# EAGLE design BBB_XM1100_CAPE (EAGLE 6.6.0)
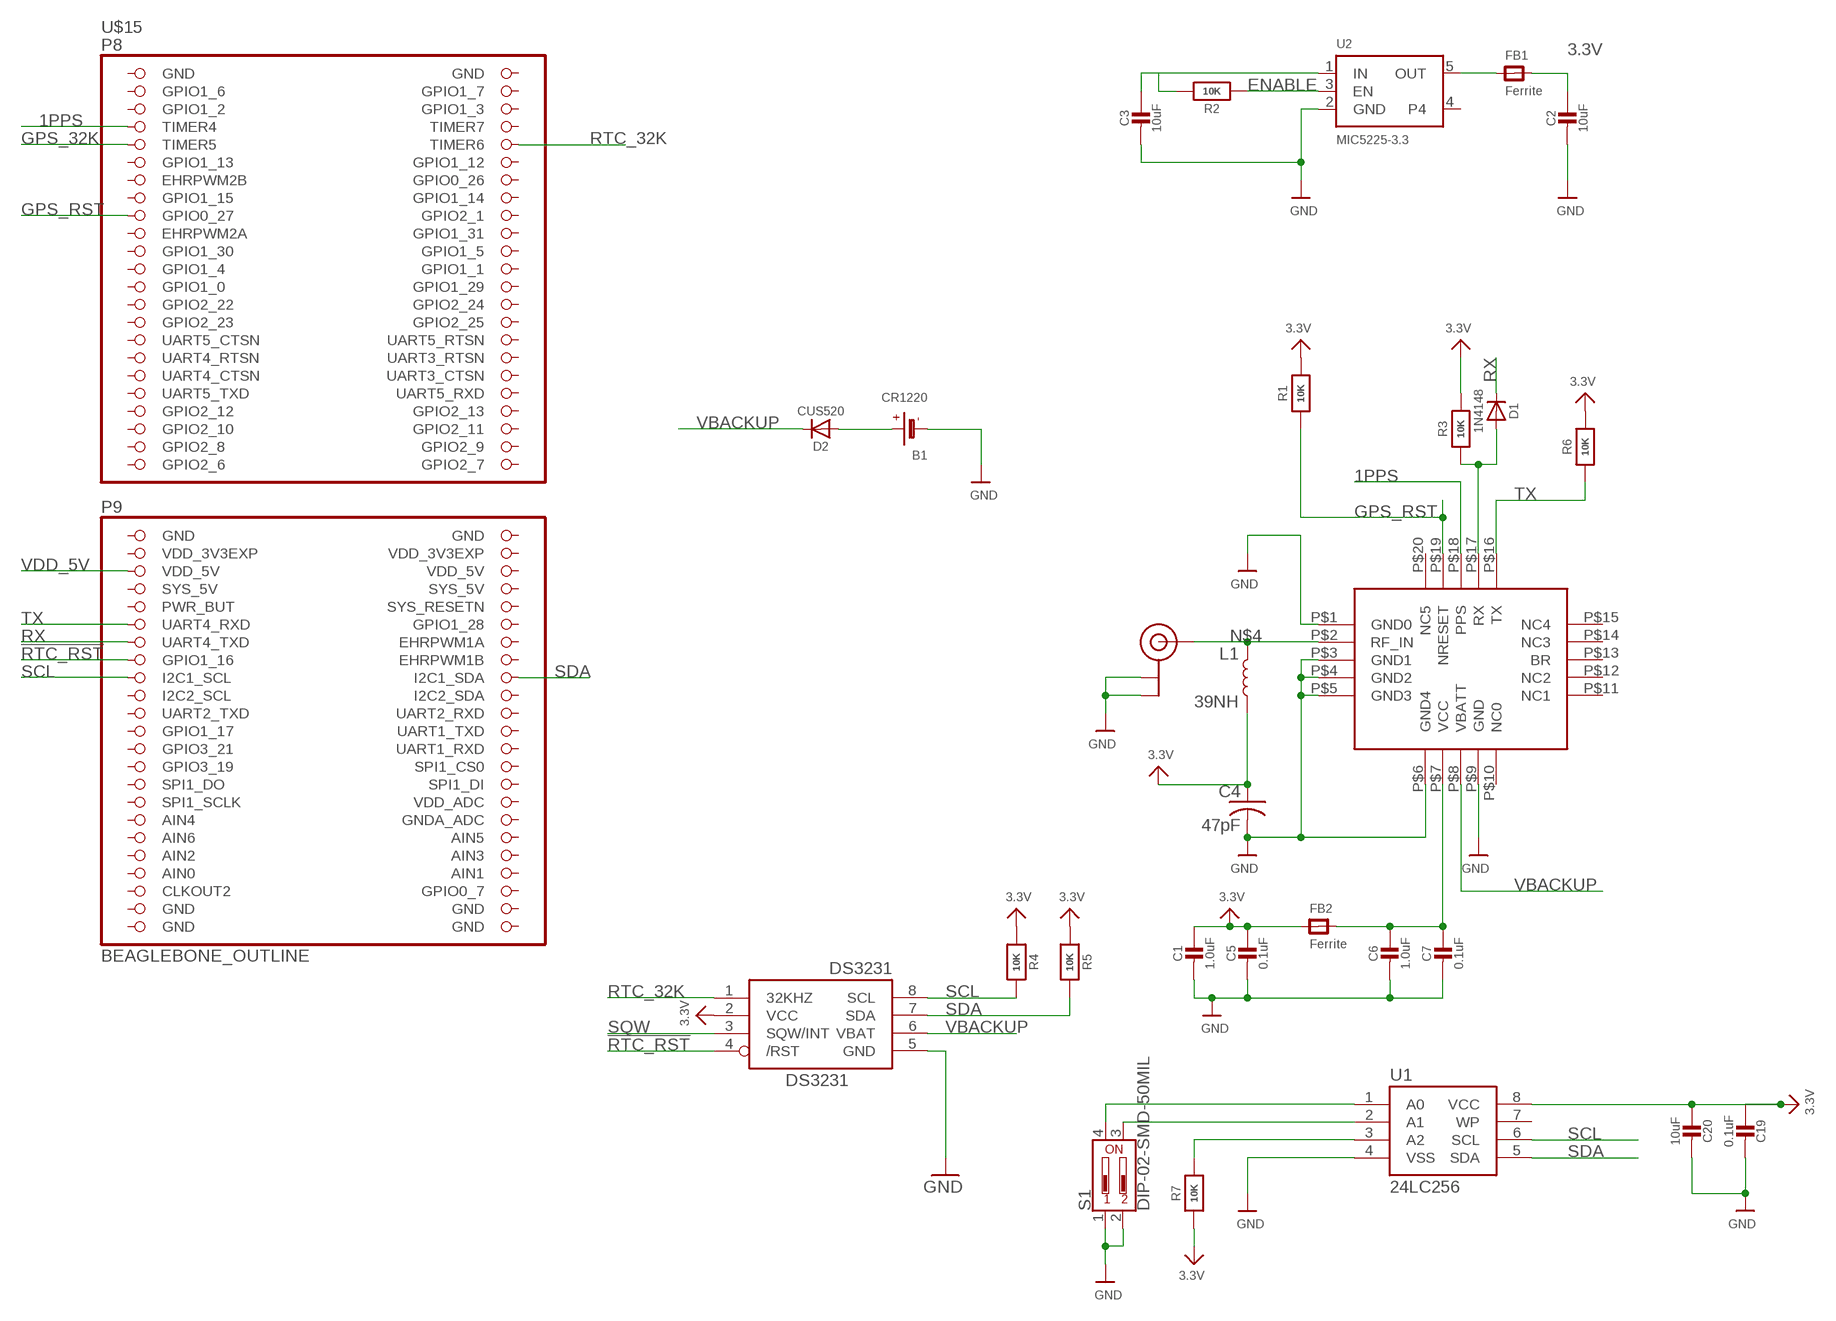
[diagram p0: schematic, sheet 1]

## Parts
B1  CR1220  BATTERYCR1220_SMT  [CR1220]
C1  1.0uF  CAP_CERAMIC0805-NOOUTLINE  [0805-NO]
C2  10uF  CAP_CERAMIC0805-NOOUTLINE  [0805-NO]
C3  10uF  CAP_CERAMIC0805-NOOUTLINE  [0805-NO]
C4  47pF  C-USC0805  [C0805]
C5  0.1uF  CAP_CERAMIC0805-NOOUTLINE  [0805-NO]
C6  1.0uF  CAP_CERAMIC0805-NOOUTLINE  [0805-NO]
C7  0.1uF  CAP_CERAMIC0805-NOOUTLINE  [0805-NO]
C19  0.1uF  CAP_CERAMIC0805-NOOUTLINE  [0805-NO]
C20  10uF  CAP_CERAMIC0805-NOOUTLINE  [0805-NO]
D1  1N4148  DIODESOD-323  [SOD-323]
D2  CUS520  DIODESOD-323  [SOD-323]
DS3231  DS3231M-8PIN  [SO08]
FB1  Ferrite  FERRITE-0805NO  [0805-NO@1]
FB2  Ferrite  FERRITE-0805NO  [0805-NO@1]
L1  39NH  INDUCTOR-0402-3.9NH  [0402]
R1  10K  RESISTOR0805_NOOUTLINE  [0805-NO]
R2  10K  RESISTOR0805_NOOUTLINE  [0805-NO]
R3  10K  RESISTOR0805_NOOUTLINE  [0805-NO]
R4  10K  RESISTOR0805_NOOUTLINE  [0805-NO]
R5  10K  RESISTOR0805_NOOUTLINE  [0805-NO]
R6  10K  RESISTOR0805_NOOUTLINE  [0805-NO]
R7  10K  RESISTOR0805_NOOUTLINE  [0805-NO]
S1  DIP-02-SMD-50MIL  [DIPSWITCH-02-50MIL]
U1  24LC256  EEPROM-I2CSMD  [SO08]
U2  MIC5225-3.3  VREG_SOT23-5  [SOT23-5]
U$3  XM1100  [XM1100]
U$15  BEAGLEBONE_OUTLINE  [BEAGLEBONE_SHIELD]
U$20  U.FL  [U.FL]

## Nets
1PPS: U$3.P$18(PPS) U$15.7(TIMER4)
3.3V: C1.1 C2.1 C4.1 C5.1 C19.1 C20.1 DS3231.2(VCC) FB1.2 FB2.1 L1.2 R1.1 R3.1 R4.1 R5.1 R6.1 R7.1 U1.8(VCC)
!RTC_RST: DS3231.4(/RST) U$15.61(GPIO1_16)
ENABLE: R2.1 U2.3(EN)
GND: B1.- C1.2 C2.2 C3.2 C4.2 C5.2 C6.2 C7.2 C19.2 C20.2 DS3231.5(GND) S1.1 S1.2 U1.4(VSS) U2.2(GND) U$3.P$1(GND0) U$3.P$3(GND1) U$3.P$4(GND2) U$3.P$5(GND3) U$3.P$6(GND4) U$3.P$9(GND) U$20.P$1(GND) U$20.P$2(GND)
GPS_32K: U$15.9(TIMER5)
GPS_RST: R1.2 U$3.P$19(NRESET) U$15.17(GPIO0_27)
N$1: B1.+$1(+) D2.A
N$3: FB1.1 U2.5(OUT)
N$4: L1.1 U$3.P$2(RF_IN) U$20.P$3(SIGNAL)
N$5: C6.1 C7.1 FB2.2 U$3.P$7(VCC)
N$13: R7.2 U1.3(A2)
N$15: S1.3 U1.2(A1)
N$16: S1.4 U1.1(A0)
RTC_32K: DS3231.1(32KHZ) U$15.10(TIMER6)
RX: D1.C U$15.59(UART4_TXD)
RX_3V: D1.A R3.2 U$3.P$17(RX)
SCL: DS3231.8(SCL) R4.2 U1.6(SCL) U$15.63(I2C1_SCL)
SDA: DS3231.7(SDA) R5.2 U1.5(SDA) U$15.64(I2C1_SDA)
SQW: DS3231.3(SQW/INT)
TX: R6.2 U$3.P$16(TX) U$15.57(UART4_RXD)
VBACKUP: D2.C DS3231.6(VBAT) U$3.P$8(VBATT)
VDD_5V: C3.1 R2.2 U2.1(IN) U$15.51(VDD_5V)
Unconnected: U1.7(WP) U2.4 U$3.P$10(NC0) U$3.P$11(NC1) U$3.P$12(NC2) U$3.P$13(BR) U$3.P$14(NC3) U$3.P$15(NC4) U$3.P$20(NC5) U$15.3(GPIO1_6) U$15.4(GPIO1_7) U$15.5(GPIO1_2) U$15.6(GPIO1_3) U$15.8(TIMER7) U$15.11(GPIO1_13) U$15.12(GPIO1_12) U$15.13(EHRPWM2B) U$15.14(GPIO0_26) U$15.15(GPIO1_15) U$15.16(GPIO1_14) U$15.18(GPIO2_1) U$15.19(EHRPWM2A) U$15.20(GPIO1_31) U$15.21(GPIO1_30) U$15.22(GPIO1_5) U$15.23(GPIO1_4) U$15.24(GPIO1_1) U$15.25(GPIO1_0) U$15.26(GPIO1_29) U$15.27(GPIO2_22) U$15.28(GPIO2_24) U$15.29(GPIO2_23) U$15.30(GPIO2_25) U$15.31(UART5_CTSN) U$15.32(UART5_RTSN) U$15.33(UART4_RTSN) U$15.34(UART3_RTSN) U$15.35(UART4_CTSN) U$15.36(UART3_CTSN) U$15.37(UART5_TXD) U$15.38(UART5_RXD) U$15.39(GPIO2_12) U$15.40(GPIO2_13) U$15.41(GPIO2_10) U$15.42(GPIO2_11) U$15.43(GPIO2_8) U$15.44(GPIO2_9) U$15.45(GPIO2_6) U$15.46(GPIO2_7) U$15.54(SYS_5V) U$15.55(PWR_BUT) U$15.56(SYS_RESETN) U$15.58(GPIO1_28) U$15.60(EHRPWM1A) U$15.62(EHRPWM1B) U$15.65(I2C2_SCL) U$15.66(I2C2_SDA) U$15.67(UART2_TXD) U$15.68(UART2_RXD) U$15.69(GPIO1_17) U$15.70(UART1_TXD) U$15.71(GPIO3_21) U$15.72(UART1_RXD) U$15.73(GPIO3_19) U$15.74(SPI1_CS0) U$15.75(SPI1_DO) U$15.76(SPI1_DI) U$15.77(SPI1_SCLK) U$15.78(VDD_ADC) U$15.79(AIN4) U$15.80(GNDA_ADC) U$15.81(AIN6) U$15.82(AIN5) U$15.83(AIN2) U$15.84(AIN3) U$15.86(AIN1) U$15.87(CLKOUT2) U$15.88(GPIO0_7)

## Power pins joined to a net without a drawn wire
AIN0: U$15.85(AIN0)
GND: U$15.1(GND) U$15.2(GND) U$15.47(GND) U$15.48(GND) U$15.89(GND) U$15.90(GND) U$15.91(GND) U$15.92(GND)
SYS_5V: U$15.53(SYS_5V)
VDD_3V3EXP: U$15.49(VDD_3V3EXP) U$15.50(VDD_3V3EXP)
VDD_5V: U$15.52(VDD_5V)

## Library data of the parts
B1 = microbuilder:BATTERY: CR1220 SMT - Digikey: 3001K-ND CD2032 BAT-HLD-001 - Digikey: BAT-HLD-001-ND
C1-C3 C5-C7 C19 C20 = microbuilder:CAP_CERAMIC: Ceramic Capacitors For new designs, use the packages preceded by an '_' character since they are more reliable: The following footprints should be used on most boards: _0402 - Standard footprint for regular board layouts _0603 - Standard footprint for regular board layouts _0805 - Standard footprint for regular board layouts _1206 - Standard footprint for regular board layouts For extremely tight-pitch boards where space is at a premium, the following 'micro-pitch' footprints can be used (smaller pads, no silkscreen outline, etc.): _0402MP - Micro-pitch footprint for very dense/compact boards _0603MP - Micro-pitch footprint for very dense/compact boards _0805MP - Micro-pitch footprint for very dense/compact boards _1206MP - Micro-pitch footprint for very dense/compact boards
C4 = rcl:C-US: CAPACITOR, American symbol
D1 D2 = microbuilder:DIODE: Diode SMA Model Volts Amps Type Vf Ir Digikey # Notes SSA34-E3 40V 3A Schottky 480mV @ 3A 200uA @ 40V SSA34-E3/61TGITR-ND CDBA120-G 20V 1A Schottky 500mV @ 1A 500uA @ 20V 641-1014-6-ND REEL MBRA210 10V 2A Schottky 350mV @ 2A 700uA @ 10V MBRA210LT3 SOD-123 Model Volts Amps Type Vf Ir Order # Notes BAT54T1G 30V 200mA Schottky 800mV @ 200mA 2uA @ 25V BAT54T1GOSTR-ND B0530W 30V 500mA Schottky 430mV @ 500mA 130uA @ 30V B0530W-FDICT-ND REEL MBR120 20V 1A Schottky 340mV @ 1A MBR120VLSFT1GOSCT-ND SOD-323 Model Volts Amps Type Vf Ir Order # Notes PMEG2005EJ 20V 500mA Schottky 355mV @ 500mA 568-4110-1-ND ZLLS410 10V 570mA Schottky 380mV @ 570mA ZLLS410CT-ND 1N4148WS 75V 150mA Silicon/Simple 1V 1N4148WSFSCT-ND REEL SOD-523 Model Volts Amps Type Vf Ir Order # Notes BAT54XV2 30V 200mA Schottky 0.8V @ 100mA BAT54XV2CT-ND TB751S 30V 30mA Schottky RB751S-40TE61CT-ND SOT23-R/W (R = Solder Paste/Reflow Ovens, W = Hand-Soldering) Model Volts Amps Type Vf Ir Order # Notes BAT54FILM 40V 300mA Schottky 497-7162-1-ND POWERDI-5 Model Volts Amps Type Vf Ir Order # Notes PDS560 60V 5A Schottky 670mV @ 5A 150uA @ 60V PDS560DICT-ND
DS3231 = tuckerLib:DS3231M-8PIN
FB1 FB2 = microbuilder:FERRITE: Ferrite Bead 0603 MMZ1608B121C - 120 Ohm @ 100MHz, 600mA, 0.15 Ohm DC Resistance - Digikey: 445-2164-1-ND BK1608HW121-T - 120 Ohm, 600mA Ferrite Chip - Digikey: 587-1876-2-ND 0805 HZ0805B272R-10 - 2.7K Ohm @ 100MHz, 200mA, 0.8 Ohm DC Resistance - Digikey: 240-2504-1-ND (see also Murata BLM21BD272SN1L) MMZ2012Y152B - 1.5K Ohm @ 100MHz, 500mA, 0.4 Ohm DC Resistance - Digikey: 445-1560-1-ND - Mainly for high frequency (80-400MHz) MMZ2012R102A - 1K Ohm @ 100MHz, 500mA, 0.3 Ohm DC Resistance - Digikey: 445-1555-2-ND - More general purpose (10-200MHz)
L1 = SparkFun-Coils:INDUCTOR: Inductors Resist changes in electrical current. Basically a coil of wire. SparkFun Products: SparkFun Load Cell Amplifier - HX711 <https://www.sparkfun.com/products/13879> IOIO-OTG - V2.2 <https://www.sparkfun.com/products/13613>; PROD_ID: NDUC-13457; VALUE: 3.9NH
R1-R7 = microbuilder:RESISTOR: Resistors For new designs, use the packages preceded by an '_' character since they are more reliable: The following footprints should be used on most boards: _0402 - Standard footprint for regular board layouts _0603 - Standard footprint for regular board layouts _0805 - Standard footprint for regular board layouts _1206 - Standard footprint for regular board layouts For extremely tight-pitch boards where space is at a premium, the following 'micro-pitch' footprints can be used (smaller pads, no silkscreen outline, etc.): _0402MP - Micro-pitch footprint for very dense/compact boards _0603MP - Micro-pitch footprint for very dense/compact boards _0805MP - Micro-pitch footprint for very dense/compact boards _1206MP - Micro-pitch footprint for very dense/compact boards
S1 = SparkFun-Switches:DIP-02: 2-Position DIP Switch 2-circuit DIP (dual inline package) switch. Commonly used to physcially set a circuit's behavior. Variants PTH-100MIL - Through-hole, 0.1"-Pitch Used on SparkFun Stepoko <https://www.sparkfun.com/products/13899> (ROB-13899) SMD-50MIL-JWING - SMD (J-Wing Pads), 0.05"-Pitch Prototype Part SMD-50MIL - SMD, 0.05"-Pitch Used on SparkFun Battery Babysitter <https://www.sparkfun.com/products/13777> (PRT-13777); PROD_ID: SWCH-13215
U1 = SparkFun-IC-Memory:EEPROM-I2C: I2C EEPROMs, 24LC256 and others 24LC256 Series 256 kb I2C 2 Wire (32 k x 8 Bit) 2.5 V Serial EEPROM SMD - SOIC-8 Datasheet SparkFun Products SparkFun UDB5 - PIC UAV Development Board <https://www.sparkfun.com/products/11703> (GPS-11703); PROD_ID: IC-09714
U2 = microbuilder:VREG_SOT23-5: SOT23-5 Fixed Voltage Regulators Part Current Out V Out V In V Dropout θJA (°C/W) TJ (°C) Digikey Part No. ADP121 150mA 3.3V 3.4-5.5V 0.09V @ 150mA -- -- ADP121-AUJZ33R7CT-ND ADP121 150mA 3.0V 3.1-5.5V 0.09V @ 150mA -- -- ADP121-AUJZ30R7CT-ND ADP122 300mA 3.3V 3.4-5.5V 0.085V @ 300mA -- -- ADP122AUJZ-3.3-R7CT-ND ADP1712 300mA 3.3V 3.5-5.5V 0.17V @ 300mA -- -- ADP1712AUJZ-3.3-R7TR-ND AP7311 (Low Cost) 150mA 3.3V 3.5-6V 0.15V @ 150mA -- -- AP7311-33WG-7DICT-ND LD39015M18R 150mA 1.8V 1.9V-5.5V 0.08V @ 100mA -- -- 497-6977-1-ND LP2985A-33DBVR 150mA 3.3V 3.3-16V 0.28V @ 150mA 206 150 296-18479-1-ND MCP1824T-3302E/OT 300mA 3.3V 3.5V-6V 0.2V @ 300mA -- -- MCP1824T-3302E/OTCT-ND MIC5205-2.5YM5 TR 150mA 2.5V 2.7-16V 0.165V @ 150mA -- -- 576-1257-2-ND MIC5205-3.0YM5 TR 150mA 3.0V 3.2V-16V 0.165V @ 150mA -- -- 576-1258-2-ND MIC5205-3.3YM5 TR 150mA 3.3V 3.5V-16V 0.165V @ 150mA -- -- 576-1259-2-ND TPS780330220 150mA 3.3V+2.2V 3.6-5.5V 250mV Max -- -- 296-23332-1-ND TDA3663/N1,135 100mA 3.3V 3.5-45V 0.18V @ 50mA -- -- 568-5343-1-ND Max operating temp can be calculated using θJA, TJ (max junction temperature), and power in watts. Set the "Maximum Ambient Temperature" until it reaches TJ ("Max Junction Temperature"), which is the absolute limit for safe use of the regulator: Heat Sink Temperature Calculator <http://www.daycounter.com/Calculators/Heat-Sink-Temperature-Calculator.phtml> For example, With 12V source into a 3.3V LP2985 and a 30mA load, we are dissipating (12V-3.3V) * 0.03A = 0.261W. With a θJA of 206 °C/W, a TJ of 150°C, and 261mW we can safely use the chip without a heat sink up to 75°C (=147.1°C Junction Temperature).
U$3 = tuckerLib:XM1100
U$15 = adafruit:BEAGLEBONE_OUTLINE: Should match A3 pinout - but not completely tested
U$20 = microbuilder:U.FL: U.FL Antenna Connector

## Board
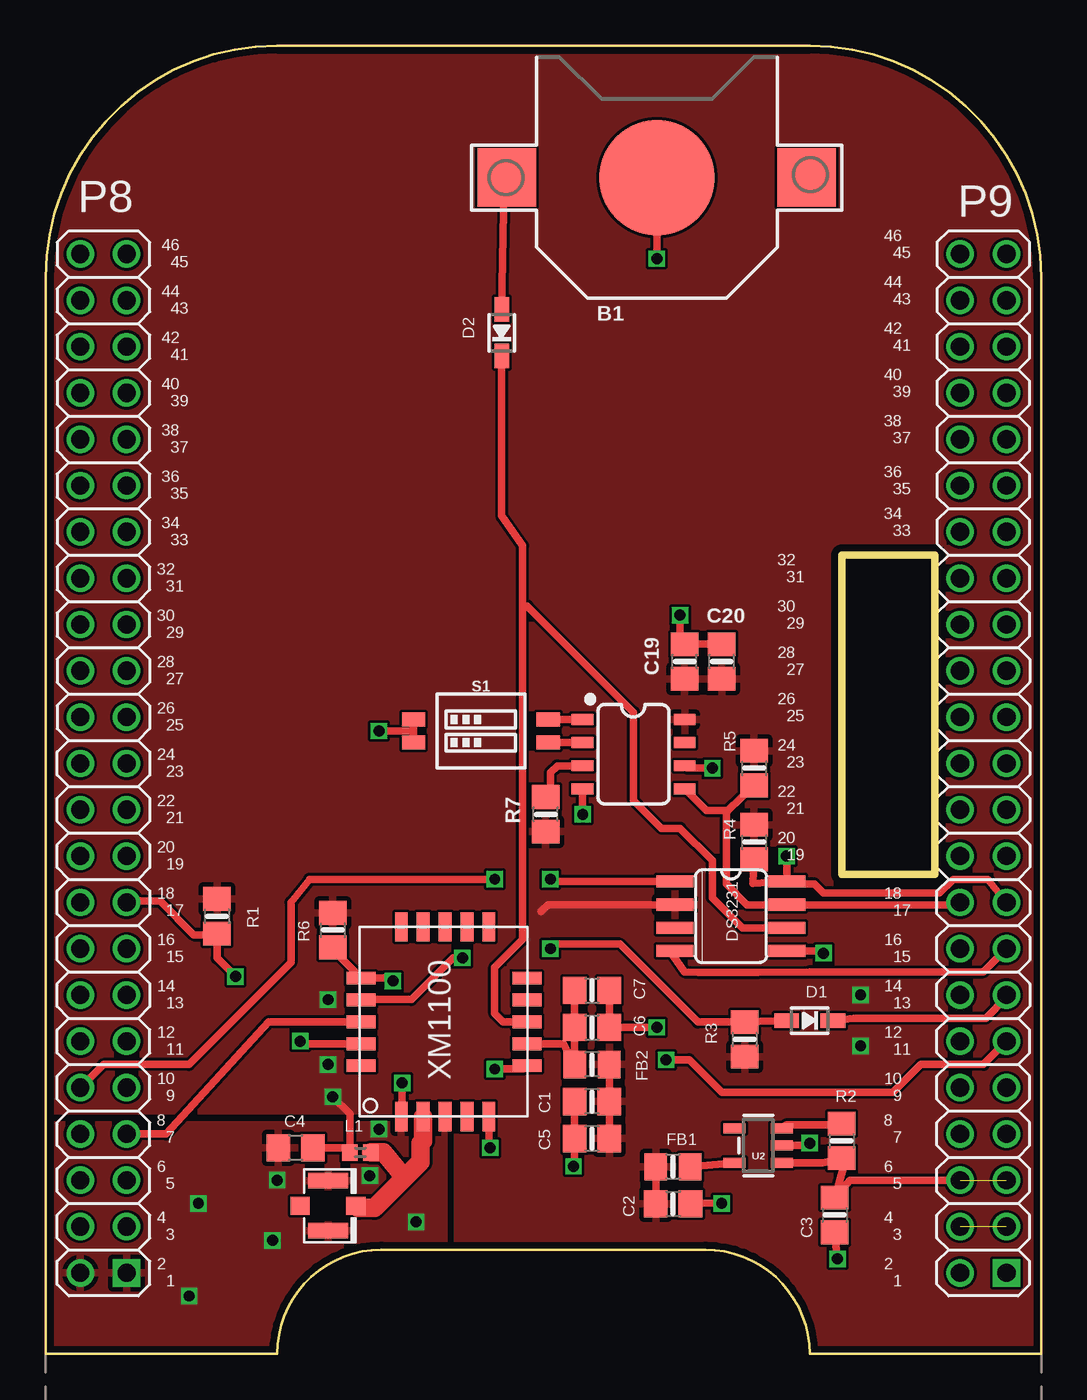
[diagram p1: board, top side]
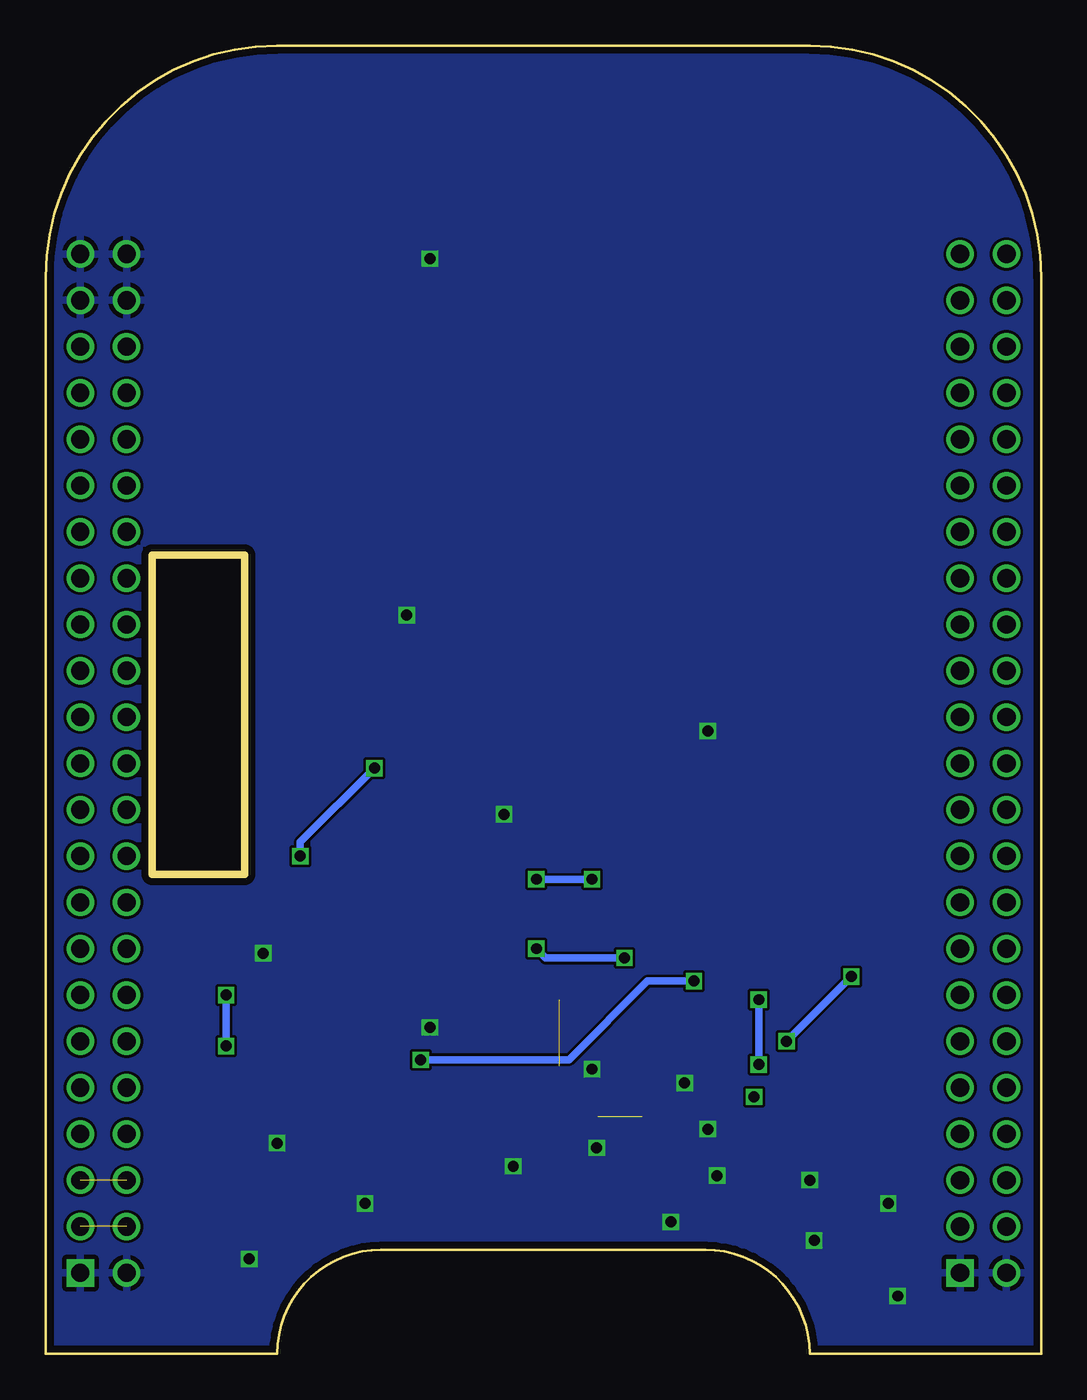
[diagram p2: board, bottom side, seen from below]

Size 54.61 x 71.76 mm. Coordinates in mm from the lower left corner, seen from the top.
Copper layers (1*16): Top 0.035559375mm / dielectric 1.6mm / Bottom 0.035559375mm
Design rules "oshpark-2layer": minimum track width 6mil, minimum drill 10mil, track to track 6mil, track to pad 6mil, pad to pad 6mil, via to via 6mil, smd to smd 6mil, copper to edge 15mil, drill to drill 6mil, minimum pad ring 5mil, minimum via ring 5mil, stop-mask expansion 2.5mil, vias tented up to drill 0mil, thermal gap 10mil
bRestrict: area 14.7,3 to 15.2,3.2; area 13.7,1.7 to 13.8,2.2; area 16.1,1.7 to 16.3,2.2

### Footprints (pad centres in the part's own frame; a part is rotated, then mirrored left to right if it is on the bottom)
CR1220 = smd 3.2 x 3.2: +$1 -8.225,0; +$2 8.225,0 | smd 6.35 x 6.35: - 0,0
0805-NO = smd 1.3 x 1.5: 1 -0.95,0; 2 0.95,0
C0805 = smd 1.3 x 1.5: 1 -0.95,0; 2 0.95,0
SOD-323 = smd 1.35 x 0.8: A 1.27,0; C -1.27,0
SO08 = smd 0.66 x 2.032: 1 -1.905,-3.073; 2 -0.635,-3.073; 3 0.635,-3.073; 4 1.905,-3.073; 5 1.905,3.073; 6 0.635,3.073; 7 -0.635,3.073; 8 -1.905,3.073
0805-NO@1 = smd 1.24 x 1.5: 1 -0.95,0; 2 0.95,0
0402 = smd 0.85 x 0.9: 1 -0.58,0; 2 0.58,0
DIPSWITCH-02-50MIL = smd 0.762 x 1.27: 1 -0.635,-3.7; 2 0.635,-3.7; 3 0.635,3.7; 4 -0.635,3.7
SO08' = smd 0.6 x 1.2: 1 -1.905,-2.8; 2 -0.635,-2.8; 3 0.635,-2.8; 4 1.905,-2.8; 5 1.905,2.8; 6 0.635,2.8; 7 -0.635,2.8; 8 -1.905,2.8
SOT23-5 = smd 0.55 x 1.2: 1 -0.95,-1.3; 2 0,-1.3; 3 0.95,-1.3; 4 0.95,1.3; 5 -0.95,1.3
XM1100 = smd 1.6 x 0.7: P$1 -6.42,4.11; P$2 -6.42,2.91; P$3 -6.42,1.71; P$4 -6.42,0.51; P$5 -6.42,-0.69; P$11 3.98,-0.69; P$12 3.98,0.51; P$13 3.98,1.71; P$14 3.98,2.91; P$15 3.98,4.11 | smd 0.7 x 1.6: P$6 -3.62,-2.79; P$7 -2.42,-2.79; P$8 -1.22,-2.79; P$9 -0.02,-2.79; P$10 1.18,-2.79; P$16 1.18,6.31; P$17 -0.02,6.31; P$18 -1.22,6.31; P$19 -2.42,6.31; P$20 -3.62,6.31
BEAGLEBONE_SHIELD = drill 1 square: 1 4.445,19.05; 47 52.705,19.05 | drill 1: 2 1.905,19.05; 3 4.445,21.59; 4 1.905,21.59; 5 4.445,24.13; 6 1.905,24.13; 7 4.445,26.67; 8 1.905,26.67; 9 4.445,29.21; 10 1.905,29.21; 11 4.445,31.75; 12 1.905,31.75; 13 4.445,34.29; 14 1.905,34.29; 15 4.445,36.83; 16 1.905,36.83; 17 4.445,39.37; 18 1.905,39.37; 19 4.445,41.91; 20 1.905,41.91; 21 4.445,44.45; 22 1.905,44.45; 23 4.445,46.99; 24 1.905,46.99; 25 4.445,49.53; 26 1.905,49.53; 27 4.445,52.07; 28 1.905,52.07; 29 4.445,54.61; 30 1.905,54.61; 31 4.445,57.15; 32 1.905,57.15; 33 4.445,59.69; 34 1.905,59.69; 35 4.445,62.23; 36 1.905,62.23; 37 4.445,64.77; 38 1.905,64.77; 39 4.445,67.31; 40 1.905,67.31; 41 4.445,69.85; 42 1.905,69.85; 43 4.445,72.39; 44 1.905,72.39; 45 4.445,74.93; 46 1.905,74.93; 48 50.165,19.05; 49 52.705,21.59; 50 50.165,21.59; 51 52.705,24.13; 52 50.165,24.13; 53 52.705,26.67; 54 50.165,26.67; 55 52.705,29.21; 56 50.165,29.21; 57 52.705,31.75; 58 50.165,31.75; 59 52.705,34.29; 60 50.165,34.29; 61 52.705,36.83; 62 50.165,36.83; 63 52.705,39.37; 64 50.165,39.37; 65 52.705,41.91; 66 50.165,41.91; 67 52.705,44.45; 68 50.165,44.45; 69 52.705,46.99; 70 50.165,46.99; 71 52.705,49.53; 72 50.165,49.53; 73 52.705,52.07; 74 50.165,52.07; 75 52.705,54.61; 76 50.165,54.61; 77 52.705,57.15; 78 50.165,57.15; 79 52.705,59.69; 80 50.165,59.69; 81 52.705,62.23; 82 50.165,62.23; 83 52.705,64.77; 84 50.165,64.77; 85 52.705,67.31; 86 50.165,67.31; 87 52.705,69.85; 88 50.165,69.85; 89 52.705,72.39; 90 50.165,72.39; 91 52.705,74.93; 92 50.165,74.93
U.FL = smd 2.2 x 0.85: P$1 0,1.375; P$2 0,-1.375 | smd 1.05 x 1: P$3 1.525,0; P$4 -1.525,0

### Placement (x,y rotation side)
B1  33.53,64.52 0 top
C1  29.97,13.84 180 top
C2  34.42,8.23 0 top
C3  43.28,7.62 270 top
C4  13.72,11.3 180 top
C5  29.97,11.81 180 top
C6  29.97,17.91 0 top
C7  29.97,19.94 0 top
C19  35.05,37.97 90 top
C20  37.08,37.97 90 top
D1  41.91,18.29 180 top
D2  25.02,56.01 90 top
DS3231  37.59,24 270 top
FB1  34.42,10.26 180 top
FB2  29.97,15.87 180 top
L1  17.27,11.05 180 top
R1  9.4,24 270 top
R2  43.66,11.68 270 top
R3  38.35,17.25 90 top
R4  38.86,28.07 270 top
R5  38.86,32.13 270 top
R6  15.75,23.24 270 top
R7  27.43,29.59 90 top
S1  23.88,34.16 270 top
U1  24LC256  [SO08']  32.26,32.89 270 top
U2  39.09,11.43 90 top
U$3  23.62,19.43 90 top
U$15  0,-14.61 0 top
U$20  15.49,8.13 0 top

### Tracks (layer width: path | path; a pad name or v marks a point on that pad's centre or on a via)
1PPS
  Top 0.406: U$3.P$18 12.24,18.21 6.6,12.06 U$15.7
3.3V  (via drill 0.6)
  Top 0.406: FB1.2 C2.1 | DS3231.2 27.56,24.64 27.18,24.26 | v15.75,14.1 16.69,13.15 L1.2 16.44,11.3 C4.1 | FB2.1 C1.1 C5.1
  Bottom 0.406: v44.7,16.89 v44.7,19.69 | v15.49,15.87 v15.49,19.43
  pour Top: 0,13.33 0,58.55 arc-90 13.21,71.76 41.91,71.76 arc-90 54.61,59.05 54.61,0.13 41.66,0.13 arc90 36.07,5.71 22.61,5.71 22.61,13.33
!RTC_RST
  Top 0.406: DS3231.4 34.42,21.84 35.05,20.95 35.81,20.92 39.08,20.92 41.91,20.95 51.44,20.95 U$15.61
ENABLE
  Top 0.406: R2.1 43.6,12.66 43.43,12.57 40.64,12.57 U2.3
GND  (via drill 0.6)  (3 unrouted)
  Top 0.406: v19.56,14.86 19.56,13.06 U$3.P$1 | C3.2 43.37,5.65 v43.43,5.21 | U2.2 41.78,11.43 v41.91,11.56 | C2.2 35.79,8.28 v37.08,8.25 | U$3.P$5 24.31,11.38 v24.38,11.3 | v24.64,15.62 26.22,15.62 U$3.P$6 | DS3231.5 42.55,22.1 v42.67,21.97 | v33.53,60.07 B1.- | v29.46,29.59 v29.46,29.6 U1.4 | C20.2 C19.2 34.8,39.18 v34.8,40.51 | S1.2 20.18,34.16 | 20.18,34.16 S1.1 | v18.29,34.16 20.18,34.16 | C7.2 C6.2 v33.53,17.91 | C1.2 C5.2 29.02,10.35 v28.96,10.29
  other vias: 8.38,8.25 7.87,3.17 12.45,6.22 12.7,9.52 17.78,9.78 20.32,7.24 18.29,12.32
  pour Bottom: 0,0.13 0,59.05 0,59.56 arc-90 12.19,71.76 42.42,71.76 arc-90 54.61,59.56 54.61,-0.13 41.66,-0.13 arc90 35.81,5.71 20.07,5.71 18.29,5.71 arc90 12.7,0.13
  pour Top: 0,-0.13 0,12.57 21.84,12.57 21.84,5.71 18.54,5.71 arc90 12.7,-0.13
GPS_RST  (via drill 0.6)
  Top 0.406: U$3.P$19 14.36,17.01 v13.97,17.14 | U$15.17 4.51,24.83 6.28,24.83 8.13,22.99 9.33,22.99 R1.2 9.4,21.72 v10.41,20.7
  Bottom 0.406: v13.97,17.14 v10.41,20.7
N$1
  Top 0.406: B1.+$1 25.15,64.01 D2.A
N$3
  Top 0.406: U2.5 FB1.1
N$4
  Top 0.406: 20.71,11.69 20.57,11.56 | 17.15,8 U$20.P$3
  Top 1.016: U$3.P$2 20.71,11.69 | 20.57,11.56 20.57,10.54 19.68,9.65 | 19.68,9.65 18.03,8 17.15,8 | L1.1 18.54,11.05 19.68,9.65
N$5
  Top 0.406: U$3.P$7 28.39,17.01 FB2.2 C6.1 C7.1
N$13
  Top 0.406: R7.2 27.69,30.8 27.69,31.88 28.07,32.26 U1.3
N$15
  Top 0.406: S1.3 U1.2
N$16
  Top 0.406: S1.4 U1.1
RTC_32K  (via drill 0.6)
  Top 0.406: DS3231.1 27.81,25.91 v27.69,26.03 | v24.64,26.03 14.48,26.03 13.46,24.77 13.46,21.46 7.87,15.87 3.18,15.87 U$15.10
  Bottom 0.406: v27.69,26.03 v24.64,26.03
RX
  Top 0.406: U$15.59 52.71,19.56 51.56,18.41 44.32,18.41 D1.C
RX_3V  (via drill 0.6)
  Top 0.406: D1.A 40.73,18.29 R3.2 35.78,18.2 31.5,22.48 27.69,22.48 v27.69,22.23 | v22.86,21.72 22.35,21.72 20.07,19.43 17.33,19.43 U$3.P$17
  Bottom 0.406: v27.69,22.23 27.18,21.72 v22.86,21.72
SCL  (via drill 0.6)
  Top 0.406: R4.2 38.8,25.81 40.13,25.88 | 40.13,25.88 DS3231.8 | U$15.63 51.69,26.03 49.78,26.03 49.02,25.27 42.67,25.27 42.16,25.78 40.23,25.78 40.13,25.88 | 40.89,25.93 DS3231.8 | U1.6 35.19,32.13 v36.58,32.13 | v40.64,27.3 40.67,27.28 DS3231.8
  Bottom 0.406: v36.58,32.13 40.64,28.07 v40.64,27.3
SDA
  Top 0.406: U$15.64 50.04,24.64 DS3231.7 38.48,24.64 37.34,25.78 37.34,29.66 37.41,29.81 | 37.41,29.81 R5.2 | U1.5 36.24,29.81 37.41,29.81
TX  (via drill 0.6)
  Top 0.406: U$15.57 51.44,15.87 48.01,15.87 46.48,14.35 37.08,14.35 35.31,16.13 v34.04,16.13 | v19.05,20.45 18.89,20.61 U$3.P$16 15.75,22.17 R6.2
  Bottom 0.406: v19.05,20.45 21.59,20.45 25.91,16.13 v34.04,16.13
VBACKUP
  Top 0.406: DS3231.6 38.23,23.37 36.58,25.02 36.58,27.05 34.8,28.83 33.78,28.83 32.26,30.35 32.26,35.18 26.42,41.02 26.16,41.02 | U$3.P$8 25.1,18.21 24.64,18.67 24.64,21.21 26.16,22.73 26.16,41.02 | 26.16,41.02 26.16,44.32 25.02,45.97 D2.C
VDD_3V3EXP  (1 unrouted)
VDD_5V  (1 unrouted)
  Top 0.406: U$15.52 44.11,9.52 C3.1 43.88,10.6 43.69,10.79 | 43.69,10.79 43.56,10.67 42.61,10.48 U2.1 | 43.69,10.79 43.69,10.88 R2.2

### Text on the board
tNames: P8 | P9 | 46 / 45 | 46 / 45 | 44 / 43 | 44 / 43 | 42 / 41 | 42 / 41 | 40 / 39 | 40 / 39 | 38 / 37 | 38 / 37 | 36 / 35 | 36 / 35 | 34 / 33 | 34 / 33 | 32 / 31 | 32 / 31 | 30 / 29 | 30 / 29 | 28 / 27 | 28 / 27 | 26 / 25 | 26 / 25 | 24 / 23 | 24 / 23 | 22 / 21 | 22 / 21 | 20 / 19 | 20 / 19 | 18 / 17 | 18 / 17 | 16 / 15 | 16 / 15 | 14 / 13 | 14 / 13 | 12 / 11 | 12 / 11 | 10 / 9 | 10 / 9 | 8 / 7 | 8 / 7 | 6 / 5 | 6 / 5 | 4 / 3 | 4 / 3 | 2 / 1 | 2 / 1